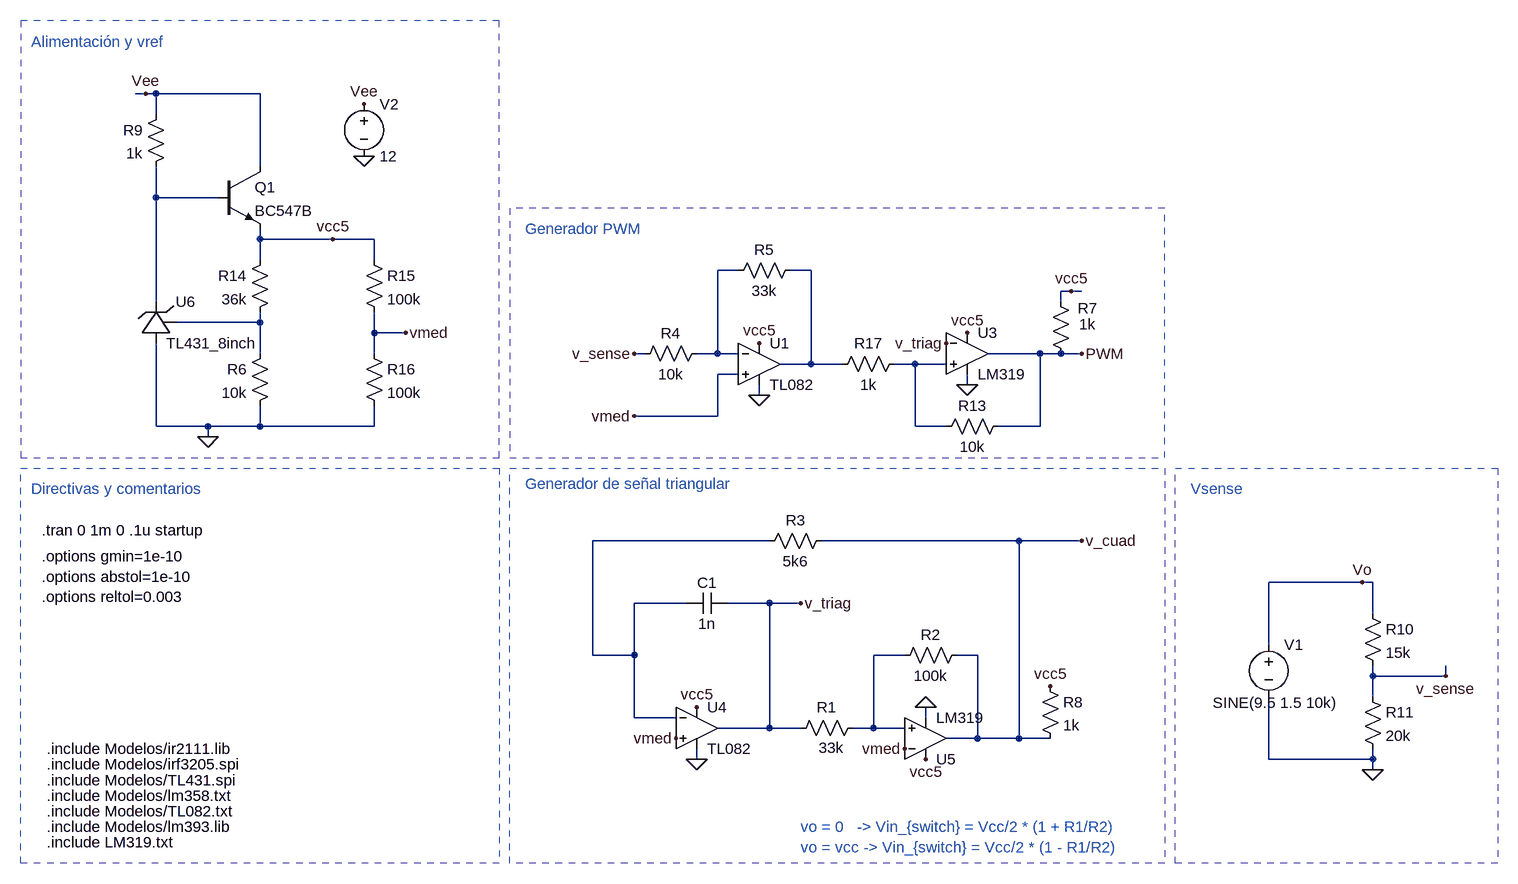
[diagram p0: schematic pwm.asc]
pwm.asc, the LTspice schematic file:
Version 4.1
SHEET 1 1732 680
WIRE -880 -1056 -896 -1056
WIRE -864 -1056 -880 -1056
WIRE -704 -1056 -864 -1056
WIRE -864 -1024 -864 -1056
WIRE -704 -944 -704 -1056
WIRE -864 -896 -864 -944
WIRE -768 -896 -864 -896
WIRE -704 -832 -704 -848
WIRE -592 -832 -704 -832
WIRE -528 -832 -592 -832
WIRE -704 -800 -704 -832
WIRE -528 -800 -528 -832
WIRE 32 -784 0 -784
WIRE 144 -784 112 -784
WIRE 544 -752 528 -752
WIRE 560 -752 544 -752
WIRE -864 -736 -864 -896
WIRE 528 -736 528 -752
WIRE -704 -704 -704 -720
WIRE -704 -704 -832 -704
WIRE -528 -688 -528 -720
WIRE -480 -688 -528 -688
WIRE -704 -656 -704 -704
WIRE -528 -656 -528 -688
WIRE -112 -656 -128 -656
WIRE 0 -656 0 -784
WIRE 0 -656 -32 -656
WIRE 32 -656 0 -656
WIRE 496 -656 416 -656
WIRE 528 -656 496 -656
WIRE 560 -656 528 -656
WIRE 144 -640 144 -784
WIRE 144 -640 96 -640
WIRE 192 -640 144 -640
WIRE 304 -640 272 -640
WIRE 352 -640 304 -640
WIRE 32 -624 0 -624
WIRE 384 -608 384 -624
WIRE 64 -592 64 -608
WIRE 0 -560 0 -624
WIRE 0 -560 -128 -560
WIRE -864 -544 -864 -672
WIRE -784 -544 -864 -544
WIRE -704 -544 -704 -576
WIRE -704 -544 -784 -544
WIRE -528 -544 -528 -576
WIRE -528 -544 -704 -544
WIRE 304 -544 304 -640
WIRE 352 -544 304 -544
WIRE 496 -544 496 -656
WIRE 496 -544 432 -544
WIRE -784 -528 -784 -544
WIRE 80 -368 -192 -368
WIRE 464 -368 160 -368
WIRE 560 -368 464 -368
WIRE 992 -304 848 -304
WIRE 1008 -304 992 -304
WIRE -48 -272 -128 -272
WIRE 80 -272 16 -272
WIRE 128 -272 80 -272
WIRE 1008 -256 1008 -304
WIRE 848 -208 848 -304
WIRE -192 -192 -192 -368
WIRE -128 -192 -128 -272
WIRE -128 -192 -192 -192
WIRE 288 -192 240 -192
WIRE 400 -192 368 -192
WIRE 1008 -160 1008 -176
WIRE 1120 -160 1120 -176
WIRE 1120 -160 1008 -160
WIRE 1008 -128 1008 -160
WIRE -128 -96 -128 -192
WIRE -64 -96 -128 -96
WIRE 320 -96 320 -112
WIRE 80 -80 80 -272
WIRE 80 -80 0 -80
WIRE 128 -80 80 -80
WIRE 240 -80 240 -192
WIRE 240 -80 208 -80
WIRE 288 -80 240 -80
WIRE 400 -64 400 -192
WIRE 400 -64 352 -64
WIRE 464 -64 464 -368
WIRE 464 -64 400 -64
WIRE 512 -64 464 -64
WIRE -32 -32 -32 -48
WIRE 848 -32 848 -128
WIRE 1008 -32 1008 -48
WIRE 1008 -32 848 -32
WIRE 1008 -16 1008 -32
FLAG 320 -112 0
FLAG 560 -368 v_cuad
FLAG -32 -32 0
FLAG 128 -272 v_triag
FLAG -64 -64 vmed
FLAG 288 -48 vmed
FLAG 64 -592 0
FLAG -784 -528 0
FLAG -880 -1056 Vee
FLAG -592 -832 vcc5
FLAG 384 -608 0
FLAG 352 -672 v_triag
FLAG 1008 -16 0
FLAG 1120 -160 v_sense
FLAG -128 -656 v_sense
FLAG -480 -688 vmed
FLAG 320 -32 vcc5
FLAG -32 -112 vcc5
FLAG 64 -672 vcc5
FLAG 384 -688 vcc5
FLAG -128 -560 vmed
FLAG 512 -144 vcc5
FLAG 544 -752 vcc5
FLAG 992 -304 Vo
FLAG 560 -656 PWM
FLAG -544 -960 0
FLAG -544 -1040 Vee
SYMBOL res 224 -96 R90
WINDOW 0 0 56 VBottom 2
WINDOW 3 31 49 VTop 2
SYMATTR InstName R1
SYMATTR Value 33k
SYMBOL res 384 -208 R90
WINDOW 0 0 56 VBottom 2
WINDOW 3 32 56 VTop 2
SYMATTR InstName R2
SYMATTR Value 100k
SYMBOL cap 16 -288 R90
WINDOW 0 0 32 VBottom 2
WINDOW 3 32 32 VTop 2
SYMATTR InstName C1
SYMATTR Value 1n
SYMBOL OpAmps\\opamp2 -32 -144 R0
SYMATTR InstName U4
SYMATTR Value TL082
SYMBOL res 176 -384 R90
WINDOW 0 0 56 VBottom 2
WINDOW 3 32 56 VTop 2
SYMATTR InstName R3
SYMATTR Value 5k6
SYMBOL OpAmps\\opamp2 64 -704 R0
SYMATTR InstName U1
SYMATTR Value TL082
SYMBOL res -16 -672 R90
WINDOW 0 0 56 VBottom 2
WINDOW 3 32 56 VTop 2
SYMATTR InstName R4
SYMATTR Value 10k
SYMBOL res 128 -800 R90
WINDOW 0 0 56 VBottom 2
WINDOW 3 32 56 VTop 2
SYMATTR InstName R5
SYMATTR Value 33k
SYMBOL res -688 -672 M0
SYMATTR InstName R6
SYMATTR Value 10k
SYMBOL res -848 -1040 M0
SYMATTR InstName R9
SYMATTR Value 1k
SYMBOL res 992 -272 R0
SYMATTR InstName R10
SYMATTR Value 15k
SYMBOL res 992 -144 R0
SYMATTR InstName R11
SYMATTR Value 20k
SYMBOL res -688 -816 M0
SYMATTR InstName R14
SYMATTR Value 36k
SYMBOL npn -768 -944 R0
SYMATTR InstName Q1
SYMATTR Value BC547B
SYMBOL res -544 -816 R0
SYMATTR InstName R15
SYMATTR Value 100k
SYMBOL res -544 -672 R0
SYMATTR InstName R16
SYMATTR Value 100k
SYMBOL OpAmps\\opamp2 384 -720 R0
SYMATTR InstName U3
SYMATTR Value LM319
SYMBOL OpAmps\\opamp2 320 0 M180
SYMATTR InstName U5
SYMATTR Value LM319
SYMBOL res 496 -160 R0
SYMATTR InstName R8
SYMATTR Value 1k
SYMBOL res 512 -752 R0
WINDOW 0 42 26 Left 2
WINDOW 3 44 51 Left 2
SYMATTR InstName R7
SYMATTR Value 1k
SYMBOL voltage 848 -224 R0
WINDOW 123 0 0 Left 0
WINDOW 39 0 0 Left 0
WINDOW 3 -86 105 Left 2
SYMATTR Value SINE(9.5 1.5 10k)
SYMATTR InstName V1
SYMBOL voltage -544 -1056 R0
WINDOW 123 0 0 Left 0
WINDOW 39 0 0 Left 0
SYMATTR InstName V2
SYMATTR Value 12
SYMBOL res 448 -560 R90
WINDOW 0 0 56 VBottom 2
WINDOW 3 32 56 VTop 2
SYMATTR InstName R13
SYMATTR Value 10k
SYMBOL res 288 -656 R90
WINDOW 0 0 56 VBottom 2
WINDOW 3 32 56 VTop 2
SYMATTR InstName R17
SYMATTR Value 1k
SYMBOL Modelos\\TL431 -864 -704 R0
SYMATTR InstName U6
TEXT -1032 72 Left 2 !.include Modelos/lm393.lib
TEXT -1040 -384 Left 2 !.tran 0 1m 0 .1u startup
TEXT 128 72 Left 2 ;vo = 0   -> Vin_{switch} = Vcc/2 * (1 + R1/R2)\nvo = vcc -> Vin_{switch} = Vcc/2 * (1 - R1/R2)
TEXT -1032 48 Left 2 !.include Modelos/TL082.txt
TEXT -1032 24 Left 2 !.include Modelos/lm358.txt
TEXT -1040 -344 Left 2 !.options gmin=1e-10\n.options abstol=1e-10\n.options reltol=0.003
TEXT -1032 0 Left 2 !.include Modelos/TL431.spi
TEXT -1056 -448 Left 2 ;Directivas y comentarios
TEXT -296 -456 Left 2 ;Generador de señal triangular
TEXT -1056 -1136 Left 2 ;Alimentación y vref
TEXT -296 -848 Left 2 ;Generador PWM
TEXT 728 -448 Left 2 ;Vsense
TEXT -1032 96 Left 2 !.include LM319.txt
TEXT -1032 -24 Left 2 !.include Modelos/irf3205.spi
TEXT -1032 -48 Left 2 !.include Modelos/ir2111.lib
RECTANGLE Normal 688 128 -320 -480 3
RECTANGLE Normal -1072 -480 -336 128 3
RECTANGLE Normal -336 -1168 -1072 -496 3
RECTANGLE Normal 688 -880 -320 -496 3
RECTANGLE Normal 1200 128 704 -480 3

The netlist it stands for:
* pwm.asc
R1 N007 v_triag 33k
R2 v_cuad N007 100k
C1 v_triag N006 1n
X§U4 vmed N006 vcc5 0 v_triag TL082  ; pins In+ In- V+ V- OUT
R3 v_cuad N006 5k6
X§U1 vmed N002 vcc5 0 N003 TL082  ; pins In+ In- V+ V- OUT
R4 N002 v_sense 10k
R5 N003 N002 33k
R6 N004 0 10k
R9 Vee N001 1k
R10 Vo v_sense 15k
R11 v_sense 0 20k
R14 vcc5 N004 36k
Q1 Vee N001 vcc5 0 BC547B
R15 vcc5 vmed 100k
R16 vmed 0 100k
X§U3 N005 v_triag vcc5 0 PWM LM319  ; pins In+ In- V+ V- OUT
X§U5 N007 vmed vcc5 0 v_cuad LM319  ; pins In+ In- V+ V- OUT
R8 vcc5 v_cuad 1k
R7 vcc5 PWM 1k
V1 Vo 0 SINE(9.5 1.5 10k)
V2 Vee 0 12
R13 PWM N005 10k
R17 N005 N003 1k
X§U6 N001 0 N004 TL431_8inch  ; pins VCC VEE ADJ
.model NPN NPN
.model PNP PNP
.lib standard.bjt
.include Modelos/lm393.lib
.tran 0 1m 0 .1u startup
* vo = 0   -> Vin_{switch} = Vcc/2 * (1 + R1/R2)
* vo = vcc -> Vin_{switch} = Vcc/2 * (1 - R1/R2)
.include Modelos/TL082.txt
.include Modelos/lm358.txt
.options gmin=1e-10
.options abstol=1e-10
.options reltol=0.003
.include Modelos/TL431.spi
* Directivas y comentarios
* Generador de señal triangular
* Alimentación y vref
* Generador PWM
* Vsense
.include LM319.txt
.include Modelos/irf3205.spi
.include Modelos/ir2111.lib
.backanno
.end